# Altium schematic sheet MCU.SchDoc
size A3; PageSetup: Record=PageOptions|CenterHorizontal=True|CenterVertical=True|PrintScale=1.00|XCorrection=1.00|YCorrection=1.00|PrintKind=1|BorderSize=5000000|LeftOffset=0|BottomOffset=0|Orientation=2|PaperLength=1000|PaperWidth=1000|Scale=100|PaperSource=7|PrintQuality=-4|MediaType=1|DitherType=10|PaperKind=A4|PrintScaleMode=1
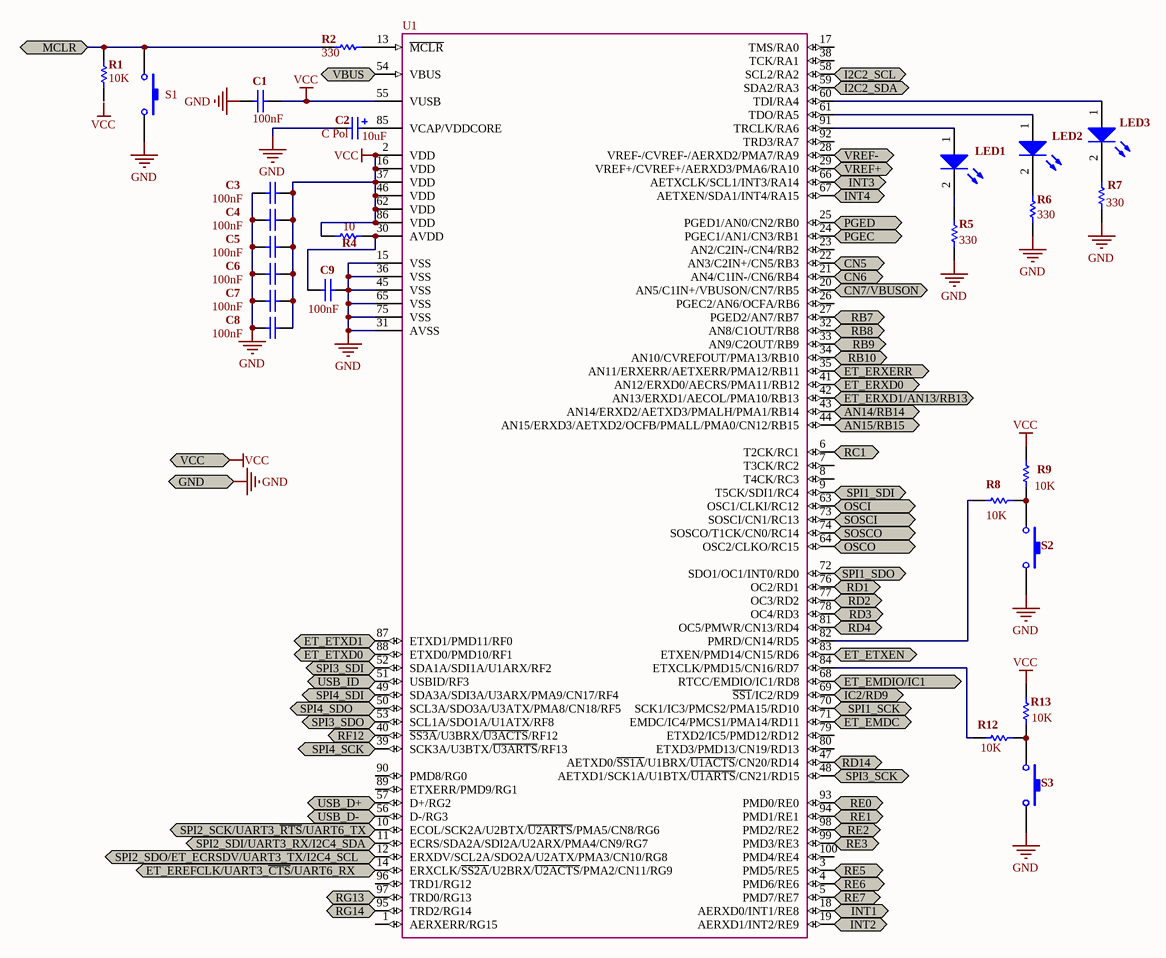
[diagram p0: MCU.SchDoc]

## Parts
C1  value 100nF  [1608[0603]]  (hidden comment: Cap)
C2  C Pol  value 10uF  [1206[3216]]
C3  value 100nF  [1608[0603]]  (hidden comment: Cap)
C4  value 100nF  [1608[0603]]  (hidden comment: Cap)
C5  value 100nF  [1608[0603]]  (hidden comment: Cap)
C6  value 100nF  [1608[0603]]  (hidden comment: Cap)
C7  value 100nF  [1608[0603]]  (hidden comment: Cap)
C8  value 100nF  [1608[0603]]  (hidden comment: Cap)
C9  value 100nF  [1608[0603]]  (hidden comment: Cap)
LED1  LED_SMD_Hg  [1608[0603]]  (value not drawn)
LED2  LED_SMD_Hg  [1608[0603]]  (value not drawn)
LED3  LED_SMD_Hg  [1608[0603]]  (value not drawn)
R1  value 10K  [1608[0603]]  (hidden comment: R)
R2  value 330  [1608[0603]]  (hidden comment: Res1)
R4  value 10  [1608[0603]]  (hidden comment: R)
R5  value 330  [1608[0603]]  (hidden comment: R)
R6  value 330  [1608[0603]]  (hidden comment: R)
R7  value 330  [1608[0603]]  (hidden comment: R)
R8  value 10K  [1608[0603]]  (hidden comment: R)
R9  value 10K  [1608[0603]]  (hidden comment: R)
R12  value 10K  [1608[0603]]  (hidden comment: R)
R13  value 10K  [1608[0603]]  (hidden comment: R)
s1_rst  S1  [Pulsador]
S2  Pulsador  [Pulsador]  (value not drawn)
S3  Pulsador  [Pulsador]  (value not drawn)
U1  PIC32MX675F512L-80I/PT  [TQFP-PT100_N]  (value not drawn)

## Ports
AN14/RB14, AN15/RB15, CN5, CN6, CN7/VBUSON, ET_EMDC, ET_EMDIO/IC1, ET_EREFCLK/UART3_~{CTS}/UART6_RX, ET_ERXD0, ET_ERXD1/AN13/RB13, ET_ERXERR, ET_ETXD0, ET_ETXD1, ET_ETXEN, GND, I2C2_SCL, I2C2_SDA, IC2/RD9, INT1, INT2, INT3, INT4, MCLR, OSCI, OSCO, PGEC, PGED, RB7, RB8, RB9, RB10, RC1, RD1, RD2, RD3, RD4, RD14, RE0, RE1, RE2, RE3, RE5, RE6, RE7, RF12, RG13, RG14, SOSCI, SOSCO, SPI1_SCK, SPI1_SDI, SPI1_SDO, SPI2_SCK/UART3_~{RTS}/UART6_TX, SPI2_SDI/UART3_RX/I2C4_SDA, SPI2_SDO/ET_ECRSDV/UART3_TX/I2C4_SCL, SPI3_SCK, SPI3_SDI, SPI3_SDO, SPI4_SCK, SPI4_SDI, SPI4_SDO, USB_D+, USB_D-, USB_ID, VBUS, VCC, VREF+, VREF-

## Nets
GND: C1.2 C2.2 C3.1 C4.1 C5.1 C6.1 C7.1 C8.1 C9.1 R5.1 R6.1 R7.1 s1_rst.2 S2.2 S3.2 U1.15(VSS) U1.31(AVSS) U1.36(VSS) U1.45(VSS) U1.65(VSS) U1.75(VSS) ; port GND
VCC: C1.1 C3.2 C4.2 C5.2 C6.2 C7.2 C8.2 R4.2 R9.2 R13.2 U1.2(VDD) U1.16(VDD) U1.37(VDD) U1.46(VDD) U1.55(VUSB) U1.62(VDD) U1.86(VDD) ; port VCC
AN14/RB14: U1.43(AN14/ERXD2/AETXD3/PMALH/PMA1/RB14) ; port AN14/RB14
AN15/RB15: U1.44(AN15/ERXD3/AETXD2/OCFB/PMALL/PMA0/CN12/RB15) ; port AN15/RB15
CN5: U1.22(AN3/C2IN+/CN5/RB3) ; port CN5
CN6: U1.21(AN4/C1IN-/CN6/RB4) ; port CN6
CN7/VBUSON: U1.20(AN5/C1IN+/VBUSON/CN7/RB5) ; port CN7/VBUSON
ET_EMDC: U1.71(EMDC/IC4/PMCS1/PMA14/RD11) ; port ET_EMDC
ET_EMDIO/IC1: U1.68(RTCC/EMDIO/IC1/RD8) ; port ET_EMDIO/IC1
ET_EREFCLK/UART3_~{CTS}/UART6_RX: U1.14(ERXCLK/~{SS2A}/U2BRX/~{U2ACTS}/PMA2/CN11/RG9) ; port ET_EREFCLK/UART3_~{CTS}/UART6_RX
ET_ERXD0: U1.41(AN12/ERXD0/AECRS/PMA11/RB12) ; port ET_ERXD0
ET_ERXD1/AN13/RB13: U1.42(AN13/ERXD1/AECOL/PMA10/RB13) ; port ET_ERXD1/AN13/RB13
ET_ERXERR: U1.35(AN11/ERXERR/AETXERR/PMA12/RB11) ; port ET_ERXERR
ET_ETXD0: U1.88(ETXD0/PMD10/RF1) ; port ET_ETXD0
ET_ETXD1: U1.87(ETXD1/PMD11/RF0) ; port ET_ETXD1
ET_ETXEN: U1.83(ETXEN/PMD14/CN15/RD6) ; port ET_ETXEN
I2C2_SCL: U1.58(SCL2/RA2) ; port I2C2_SCL
I2C2_SDA: U1.59(SDA2/RA3) ; port I2C2_SDA
IC2/RD9: U1.69(~{SS1}/IC2/RD9) ; port IC2/RD9
INT1: U1.18(AERXD0/INT1/RE8) ; port INT1
INT2: U1.19(AERXD1/INT2/RE9) ; port INT2
INT3: U1.66(AETXCLK/SCL1/INT3/RA14) ; port INT3
INT4: U1.67(AETXEN/SDA1/INT4/RA15) ; port INT4
MCLR: R1.1 R2.1 s1_rst.1 ; port MCLR
OSCI: U1.63(OSC1/CLKI/RC12) ; port OSCI
OSCO: U1.64(OSC2/CLKO/RC15) ; port OSCO
PGEC: U1.24(PGEC1/AN1/CN3/RB1) ; port PGEC
PGED: U1.25(PGED1/AN0/CN2/RB0) ; port PGED
RB7: U1.27(PGED2/AN7/RB7) ; port RB7
RB8: U1.32(AN8/C1OUT/RB8) ; port RB8
RB9: U1.33(AN9/C2OUT/RB9) ; port RB9
RB10: U1.34(AN10/CVREFOUT/PMA13/RB10) ; port RB10
RC1: U1.6(T2CK/RC1) ; port RC1
RD1: U1.76(OC2/RD1) ; port RD1
RD2: U1.77(OC3/RD2) ; port RD2
RD3: U1.78(OC4/RD3) ; port RD3
RD4: U1.81(OC5/PMWR/CN13/RD4) ; port RD4
RD14: U1.47(AETXD0/~{SS1A}/U1BRX/~{U1ACTS}/CN20/RD14) ; port RD14
RE0: U1.93(PMD0/RE0) ; port RE0
RE1: U1.94(PMD1/RE1) ; port RE1
RE2: U1.98(PMD2/RE2) ; port RE2
RE3: U1.99(PMD3/RE3) ; port RE3
RE5: U1.3(PMD5/RE5) ; port RE5
RE6: U1.4(PMD6/RE6) ; port RE6
RE7: U1.5(PMD7/RE7) ; port RE7
RF12: U1.40(~{SS3A}/U3BRX/~{U3ACTS}/RF12) ; port RF12
RG13: U1.97(TRD0/RG13) ; port RG13
RG14: U1.95(TRD2/RG14) ; port RG14
SOSCI: U1.73(SOSCI/CN1/RC13) ; port SOSCI
SOSCO: U1.74(SOSCO/T1CK/CN0/RC14) ; port SOSCO
SPI1_SCK: U1.70(SCK1/IC3/PMCS2/PMA15/RD10) ; port SPI1_SCK
SPI1_SDI: U1.9(T5CK/SDI1/RC4) ; port SPI1_SDI
SPI1_SDO: U1.72(SDO1/OC1/INT0/RD0) ; port SPI1_SDO
SPI2_SCK/UART3_~{RTS}/UART6_TX: U1.10(ECOL/SCK2A/U2BTX/~{U2ARTS}/PMA5/CN8/RG6) ; port SPI2_SCK/UART3_~{RTS}/UART6_TX
SPI2_SDI/UART3_RX/I2C4_SDA: U1.11(ECRS/SDA2A/SDI2A/U2ARX/PMA4/CN9/RG7) ; port SPI2_SDI/UART3_RX/I2C4_SDA
SPI2_SDO/ET_ECRSDV/UART3_TX/I2C4_SCL: U1.12(ERXDV/SCL2A/SDO2A/U2ATX/PMA3/CN10/RG8) ; port SPI2_SDO/ET_ECRSDV/UART3_TX/I2C4_SCL
SPI3_SCK: U1.48(AETXD1/SCK1A/U1BTX/~{U1ARTS}/CN21/RD15) ; port SPI3_SCK
SPI3_SDI: U1.52(SDA1A/SDI1A/U1ARX/RF2) ; port SPI3_SDI
SPI3_SDO: U1.53(SCL1A/SDO1A/U1ATX/RF8) ; port SPI3_SDO
SPI4_SCK: U1.39(SCK3A/U3BTX/~{U3ARTS}/RF13) ; port SPI4_SCK
SPI4_SDI: U1.49(SDA3A/SDI3A/U3ARX/PMA9/CN17/RF4) ; port SPI4_SDI
SPI4_SDO: U1.50(SCL3A/SDO3A/U3ATX/PMA8/CN18/RF5) ; port SPI4_SDO
USB_D+: U1.57(D+/RG2) ; port USB_D+
USB_D-: U1.56(D-/RG3) ; port USB_D-
USB_ID: U1.51(USBID/RF3) ; port USB_ID
VBUS: U1.54(VBUS) ; port VBUS
VREF+: U1.29(VREF+/CVREF+/AERXD3/PMA6/RA10) ; port VREF+
VREF-: U1.28(VREF-/CVREF-/AERXD2/PMA7/RA9) ; port VREF-
NetC2_1: C2.1 U1.85(VCAP/VDDCORE)
NetC9_2: C9.2 R4.1 U1.30(AVDD)
NetLED1_1: LED1.1(A) U1.91(TRCLK/RA6)
NetLED1_2: LED1.2(K) R5.2
NetLED2_1: LED2.1(A) U1.61(TDO/RA5)
NetLED2_2: LED2.2(K) R6.2
NetLED3_1: LED3.1(A) U1.60(TDI/RA4)
NetLED3_2: LED3.2(K) R7.2
NetR2_2: R2.2 U1.13(~{MCLR})
NetR8_1: R8.1 R9.1 S2.1
NetR8_2: R8.2 U1.82(PMRD/CN14/RD5)
NetR12_1: R12.1 R13.1 S3.1
NetR12_2: R12.2 U1.84(ETXCLK/PMD15/CN16/RD7)

Not connected (* = marked no-connect by the designer): R1 2; U1 1(AERXERR/RG15) 7(T3CK/RC2) 8(T4CK/RC3) 17(TMS/RA0) 23(AN2/C2IN-/CN4/RB2) 26(PGEC2/AN6/OCFA/RB6) 38(TCK/RA1) 79(ETXD2/IC5/PMD12/RD12) 80(ETXD3/PMD13/CN19/RD13) 89(ETXERR/PMD9/RG1) 90(PMD8/RG0) 92(TRD3/RA7) 96(TRD1/RG12) 100(PMD4/RE4)

## Notes on the sheet
- Labels drawn without touching a wire or pin: VCC
- Title
- Size:
- Date:
- A3
- Number:
- Time:
- Revision:
- Sheet
- of
- File:

## Library data of the parts
C1 C3-C9 = Cap: Capacitor; Published: 8-Jun-2000; LatestRevisionDate: 17-Jul-2002; LatestRevisionNote: Re-released for DXP Platform.; PackageReference: RAD-0.3; Publisher: Altium Limited; PackageDescription: Radial Cap, Thru-Hole; 2 Leads; 0.3 in Pin Spacing
C2 = C Pol: Polarized Capacitor (Surface Mount); Manufacturer: Generic Components; Class: Passive; Published: 08/06/2000; Publisher: Altium Hobart Technology Centre; SubClass: Capacitor
LED1-LED3 = LED_SMD_Hg: Typical BLUE SiC LED; Manufacturer: Generic Components; Class: Optoelectronic; Published: 08/06/2000; Publisher: Altium Hobart Technology Centre; SubClass: LED
R1 R4-R9 R12 R13 = R: Resistor; Manufacturer: Generic Components; Class: Passive; Published: 08/06/2000; Publisher: Altium Hobart Technology Centre; SubClass: Resistor
R2 = Res1: Resistor; Published: 8-Jun-2000; LatestRevisionDate: 17-Jul-2002; LatestRevisionNote: Re-released for DXP Platform.; PackageReference: AXIAL-0.3; Publisher: Altium Limited; PackageDescription: Axial Device, Thru-Hole; 2 Leads; 0.3 in Pin Spacing
s1_rst S2 S3 = Pulsador: Switch; Manufacturer: Generic Components; Published: 1999
U1 = PIC32MX675F512L-80I/PT: High Performance 80 MHz MIPS-Based 32-Bit Flash Microcontroller with USB and Ethernet, 512KB Program Memory, 100-pin TQFP, Industrial Temperature; FirstPublished: 2-Dec-2009; DatasheetVersion: revB, Nov-2009; PackageVersion: revBB, Aug-2009; PackageReference: TQFP-PT100; Publisher: Altium Limited; PackageDescription: 100-Lead Plastic Thin Quad Flatpack (PT) - 12x12x1mm Body, 2.00mm [TQFP]; Supplier 1: Digi-Key; Supplier Part Number 1: PIC32MX675F512L-80I/PT-ND; Supplier 2: Newark; Supplier Part Number 2: 25R8403; ComponentLink1Description: Datasheet; ComponentLink1URL: http://ww1.microchip.com/downloads/en/DeviceDoc/DS-61156B.pdf; ComponentLink2Description: Packaging Specification; ComponentLink2URL: http://ww1.microchip.com/downloads/en/PackagingSpec/en012702.pdf; ComponentLink3Description: Microchip.com Home; ComponentLink3URL: http://www.microchip.com/